# Altium project uz_per_mw_vfd_interface.PrjPCB (part 1 of 2)
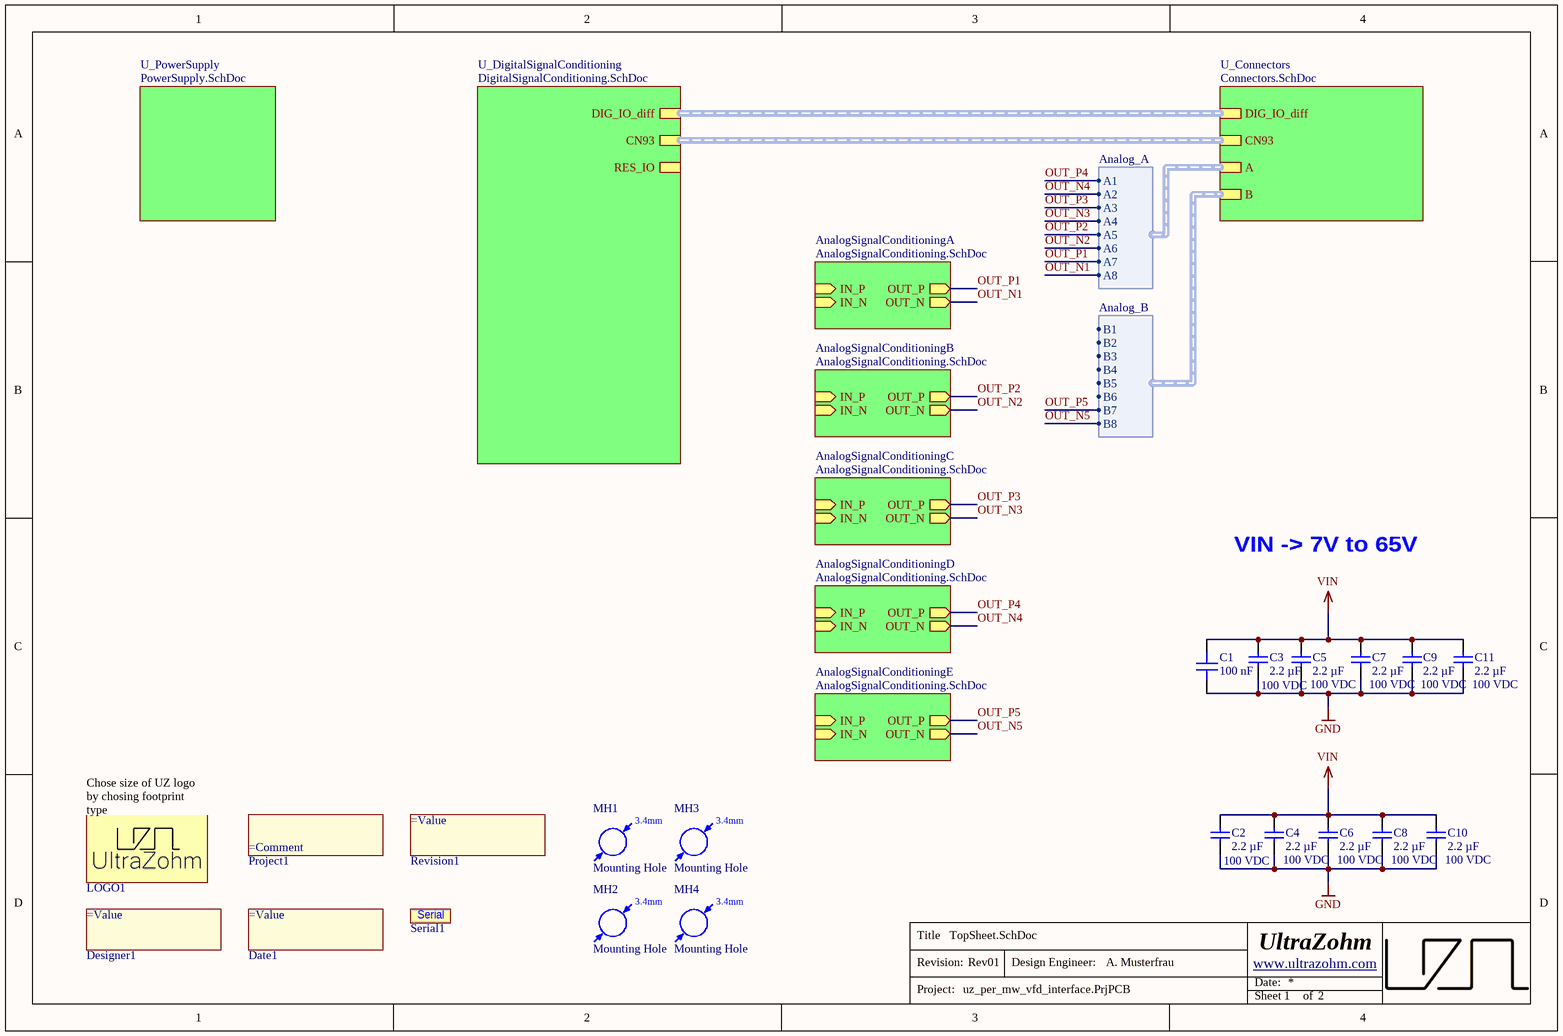
[diagram p0: TopSheet.SchDoc]
Author: A. Musterfrau; AuthorParam: A. Musterfrau; FinDate: 02/23; ProjectNameCustom: UZ_D_Template; ProjectRevision: Rev01
6 sheets, 281 parts. Net scope: hierarchical (ports join the sheet entries above them; power ports are global).
Board file: uz_per_mw_vfd_interface.PcbDoc
Sheets:
  TopSheet.SchDoc
    U_Connectors = Connectors.SchDoc
    U_PowerSupply = PowerSupply.SchDoc
    U_DigitalSignalConditioning = DigitalSignalConditioning.SchDoc
    AnalogSignalConditioningA = AnalogSignalConditioning.SchDoc
    AnalogSignalConditioningB = AnalogSignalConditioning.SchDoc
    AnalogSignalConditioningC = AnalogSignalConditioning.SchDoc
    AnalogSignalConditioningD = AnalogSignalConditioning.SchDoc
    AnalogSignalConditioningE = AnalogSignalConditioning.SchDoc
  DigitalIsolation.SchDoc

## Sheet TopSheet.SchDoc
size A4; Author: A. Musterfrau; CompanyName: Technische Hochschule Nürnberg Georg Simon Ohm; Organization: UltraZohm; Address1: Kesslerplatz 12; Address2: 90489 Nürnberg; Address3: GERMANY; DocumentNumber: 1; SheetNumber: 1; SheetTotal: 2; Website: www.ultrazohm.com

### Parts
C1  100 nF  [C_0603]
C2  2.2 µF  Voltage Rating: 100 VDC  [C_1210_TE]
C3  2.2 µF  Voltage Rating: 100 VDC  [C_1210_TE]
C4  2.2 µF  Voltage Rating: 100 VDC  [C_1210_TE]
C5  2.2 µF  Voltage Rating: 100 VDC  [C_1210_TE]
C6  2.2 µF  Voltage Rating: 100 VDC  [C_1210_TE]
C7  2.2 µF  Voltage Rating: 100 VDC  [C_1210_TE]
C8  2.2 µF  Voltage Rating: 100 VDC  [C_1210_TE]
C9  2.2 µF  Voltage Rating: 100 VDC  [C_1210_TE]
C10  2.2 µF  Voltage Rating: 100 VDC  [C_1210_TE]
C11  2.2 µF  Voltage Rating: 100 VDC  [C_1210_TE]
Date1  (no value)  [COMMENT]  (no BOM)
Designer1  (no value)  [Designator:comment]  (no BOM)
LOGO1  UZ Logo  [UZ_Logo_small]  (value not drawn)  (no BOM)
MH1  Mounting Hole  [MH_3.4]
MH2  Mounting Hole  [MH_3.4]
MH3  Mounting Hole  [MH_3.4]
MH4  Mounting Hole  [MH_3.4]
Project1  (no value)  [COMMENT]  (no BOM)
Revision1  (no value)  [Designator:comment]  (no BOM)
Serial1  Serial #  [SERIAL]  (value not drawn)

### Sub-sheets
AnalogSignalConditioningA = AnalogSignalConditioning.SchDoc: OUT_P (out), OUT_N (out), IN_P (in), IN_N (in)
AnalogSignalConditioningB = AnalogSignalConditioning.SchDoc: OUT_P (out), OUT_N (out), IN_P (in), IN_N (in)
AnalogSignalConditioningC = AnalogSignalConditioning.SchDoc: OUT_P (out), OUT_N (out), IN_P (in), IN_N (in)
AnalogSignalConditioningD = AnalogSignalConditioning.SchDoc: OUT_P (out), OUT_N (out), IN_P (in), IN_N (in)
AnalogSignalConditioningE = AnalogSignalConditioning.SchDoc: OUT_P (out), OUT_N (out), IN_P (in), IN_N (in)
U_Connectors = Connectors.SchDoc: DIG_IO_diff (harness DIG_IO_diff), CN93 (harness Connector CN93), A (harness Analog_A), B (harness Analog_B)
U_DigitalSignalConditioning = DigitalSignalConditioning.SchDoc: DIG_IO_diff (harness DIG_IO_diff), CN93 (harness Connector CN93), RES_IO (harness RES_IO)
U_PowerSupply = PowerSupply.SchDoc: no entries

### Harnesses
Analog_A: A1, A2, A3, A4, A5, A6, A7, A8
Analog_B: B1, B2, B3, B4, B5, B6, B7, B8

### Nets
GND: C1.2 C2.2 C3.2 C4.2 C5.2 C6.2 C7.2 C8.2 C9.2 C10.2 C11.2
VIN: C1.1 C2.1 C3.1 C4.1 C5.1 C6.1 C7.1 C8.1 C9.1 C10.1 C11.1
OUT_N1: sheet AnalogSignalConditioningA/OUT_N, sheet U_Connectors/A.A8
OUT_N2: sheet AnalogSignalConditioningB/OUT_N, sheet U_Connectors/A.A6
OUT_N3: sheet AnalogSignalConditioningC/OUT_N, sheet U_Connectors/A.A4
OUT_N4: sheet AnalogSignalConditioningD/OUT_N, sheet U_Connectors/A.A2
OUT_N5: sheet AnalogSignalConditioningE/OUT_N, sheet U_Connectors/B.B8
OUT_P1: sheet AnalogSignalConditioningA/OUT_P, sheet U_Connectors/A.A7
OUT_P2: sheet AnalogSignalConditioningB/OUT_P, sheet U_Connectors/A.A5
OUT_P3: sheet AnalogSignalConditioningC/OUT_P, sheet U_Connectors/A.A3
OUT_P4: sheet AnalogSignalConditioningD/OUT_P, sheet U_Connectors/A.A1
OUT_P5: sheet AnalogSignalConditioningE/OUT_P, sheet U_Connectors/B.B7

### Buses and harness runs
harness sheet U_Connectors/CN93 = sheet U_DigitalSignalConditioning/CN93
harness sheet U_Connectors/DIG_IO_diff = sheet U_DigitalSignalConditioning/DIG_IO_diff

### Notes on the sheet
- VIN -> 7V to 65V
- (near LOGO1) Chose size of UZ logo by chosing footprint type
- Title
- Revision:
- Design Engineer:
- Date:
- Project:
- Sheet
- of
- (in symbol 6) Serial
- (in symbol Mounting Hole) 3.4mm

### Library data of the parts
C1 = C1608X7S2A104KT000N: 100V 100nF X7S ±10% 0603 Multilayer Ceramic Capacitors MLCC - SMD/SMT ROHS; Manufacturer: TDK; Voltage Rating: 100 VDC; Created from: AGeiger; Value: 100 nF; Supplier 1: LCSC; Supplier Part Number 1: C343025; Tolerance: 10 %; LCSC Part Number: C343025; Manufacturer Part Number: C1608X7S2A104KT000N; PartID: 148; Created On: 20/12/2020 13:54:13; ComponentLink1Description: Datasheet; ComponentLink1URL: https://datasheet.lcsc.com/lcsc/2304140030_TDK-C1608X7S2A104KT000N_C343025.pdf; Component Type: Capacitor 0603; Device Package: 0603; Last Updated: 14/12/2022 12:14:21; Mounting Type: SMD; Operating Temperature: -55 to 125°C; Series: X7R; Type: Capacitor; Live Cycle Status: 1; Stock number: not stored
C2-C11 = FS32X225K101EGG: 100V 2.2uF X7R ±10% 1210 Multilayer Ceramic Capacitors MLCC - SMD/SMT ROHS; Manufacturer: PSA(Prosperity Dielectrics); Created from: AGeiger; Manufacturer Part Number: FS32X225K101EGG; PartID: 170; Created On: 11.03.2025 16:22:30; ComponentLink1Description: Datasheet; ComponentLink1URL: https://www.lcsc.com/datasheet/lcsc_datasheet_2410121308_PSA-Prosperity-Dielectrics-FS32X225K101EGG_C153036.pdf; Component Type: Capacitor 1210; Device Package: 1210; Last Updated: 27.05.2025 19:11:48; Mounting Type: SMD; Operating Temperature: -55 to +125°C; Series: FS; Supplier 1: LCSC; Supplier Part Number 1: C153036; Type: Capacitor; Tolerance: 10%; Value: 2.2 µF; Live Cycle Status: 1; LCSC Part Number: C153036
Date1 = 5: Create a project parameter named "FinDate" this is the value of this component. It is printed on the PCB. Once the parameter is updated (e.g. new revision) it gets updated on the PCB as well; Manufacturer: PCB Manufacturer; Manufacturer Part Number: Project End Date; Value: 02/23; Created from: T. Wendt; PartID: 5; Created On: 01.03.2021 09:01:41; Component Type: Date of Project Finalization; Last Updated: 01.03.2021 09:01:41; Type: Standard (No BOM); Live Cycle Status: 1
Designer1 = 4: Create a project parameter named "Author" this is the value of this component. It is printed on the PCB. Once the parameter is updated (e.g. new revision) it gets updated on the PCB as well; Manufacturer: PCB Manufacturer; Manufacturer Part Number: Project Author; Value: A. Musterfrau; Created from: T. Wendt; PartID: 4; Created On: 01.03.2021 08:53:41; Component Type: Project Author; Last Updated: 01.03.2021 09:20:27; Type: Standard (No BOM); Live Cycle Status: 1
LOGO1 = 1: Official Project Logo of the UltraZohm; Manufacturer: PCB Manufacturer; Manufacturer Part Number: UltraZohm Logo; Created from: T. Wendt; PartID: 1; Created On: 19.02.2021 16:55:56; ComponentLink1Description: Homepage; ComponentLink1URL: https://ultrazohm.com; Component Type: Logo; Last Updated: 02.03.2021 14:31:24; Type: Standard (No BOM); Live Cycle Status: 1
MH1-MH4 = Mounting Hole: Created from: MHlatky; Manufacturer Part Number: Mounting Hole; PartID: 16; Created On: 26.01.2021 09:19:51; ComponentLink1Description: Datasheet; Component Type: Mounting Hole; Device Package: -; Last Updated: 21.03.2022 23:05:12; Manufacturer: Mounting Hole; Supplier 1: Mounting Hole; Supplier Part Number 1: Mounting Hole; Type: Mounting Hole; Value: Mounting Hole; Live Cycle Status: 1; Stock number: not stored
Project1 = 2: Create a project parameter named "ProjectNameCustom" this is the value of this component and it is printed on the PCB.; Manufacturer: PCB Manufacturer; Value: UZ_D_Template; Created from: T. Wendt; PartID: 2; Created On: 01.03.2021 08:43:57; Component Type: Project Name; Last Updated: 01.03.2021 09:07:27; Manufacturer Part Number: Project Name; Type: Standard (No BOM); Live Cycle Status: 1
Revision1 = 3: Create a project parameter named "ProjectRevision" this is the value of this component. It is printed on the PCB. Once the parameter is updated (e.g. new revision) it gets updated on the PCB as well; Manufacturer: PCB Manufacturer; Value: Rev01; Created from: T. Wendt; PartID: 3; Created On: 01.03.2021 08:50:34; Component Type: Project Revision; Last Updated: 01.03.2021 09:28:36; Manufacturer Part Number: Project Revision; Type: Standard (No BOM); Live Cycle Status: 1
Serial1 = 6: Field to put in a serial number; Manufacturer: PCB Manufacturer; Created from: T. Wendt; PartID: 6; Created On: 02.03.2021 14:31:24; Component Type: Serial Number; Last Updated: 02.03.2021 14:31:24; Manufacturer Part Number: Serial Number; Type: Standard (No BOM); Live Cycle Status: 1

## Sheet Connectors.SchDoc
size A4; Author: A. Musterfrau; CompanyName: Technische Hochschule Nürnberg Georg Simon Ohm; Organization: UltraZohm; Address1: Kesslerplatz 12; Address2: 90489 Nürnberg; Address3: GERMANY; DocumentNumber: 2; SheetNumber: 2; SheetTotal: 2; Website: www.ultrazohm.com
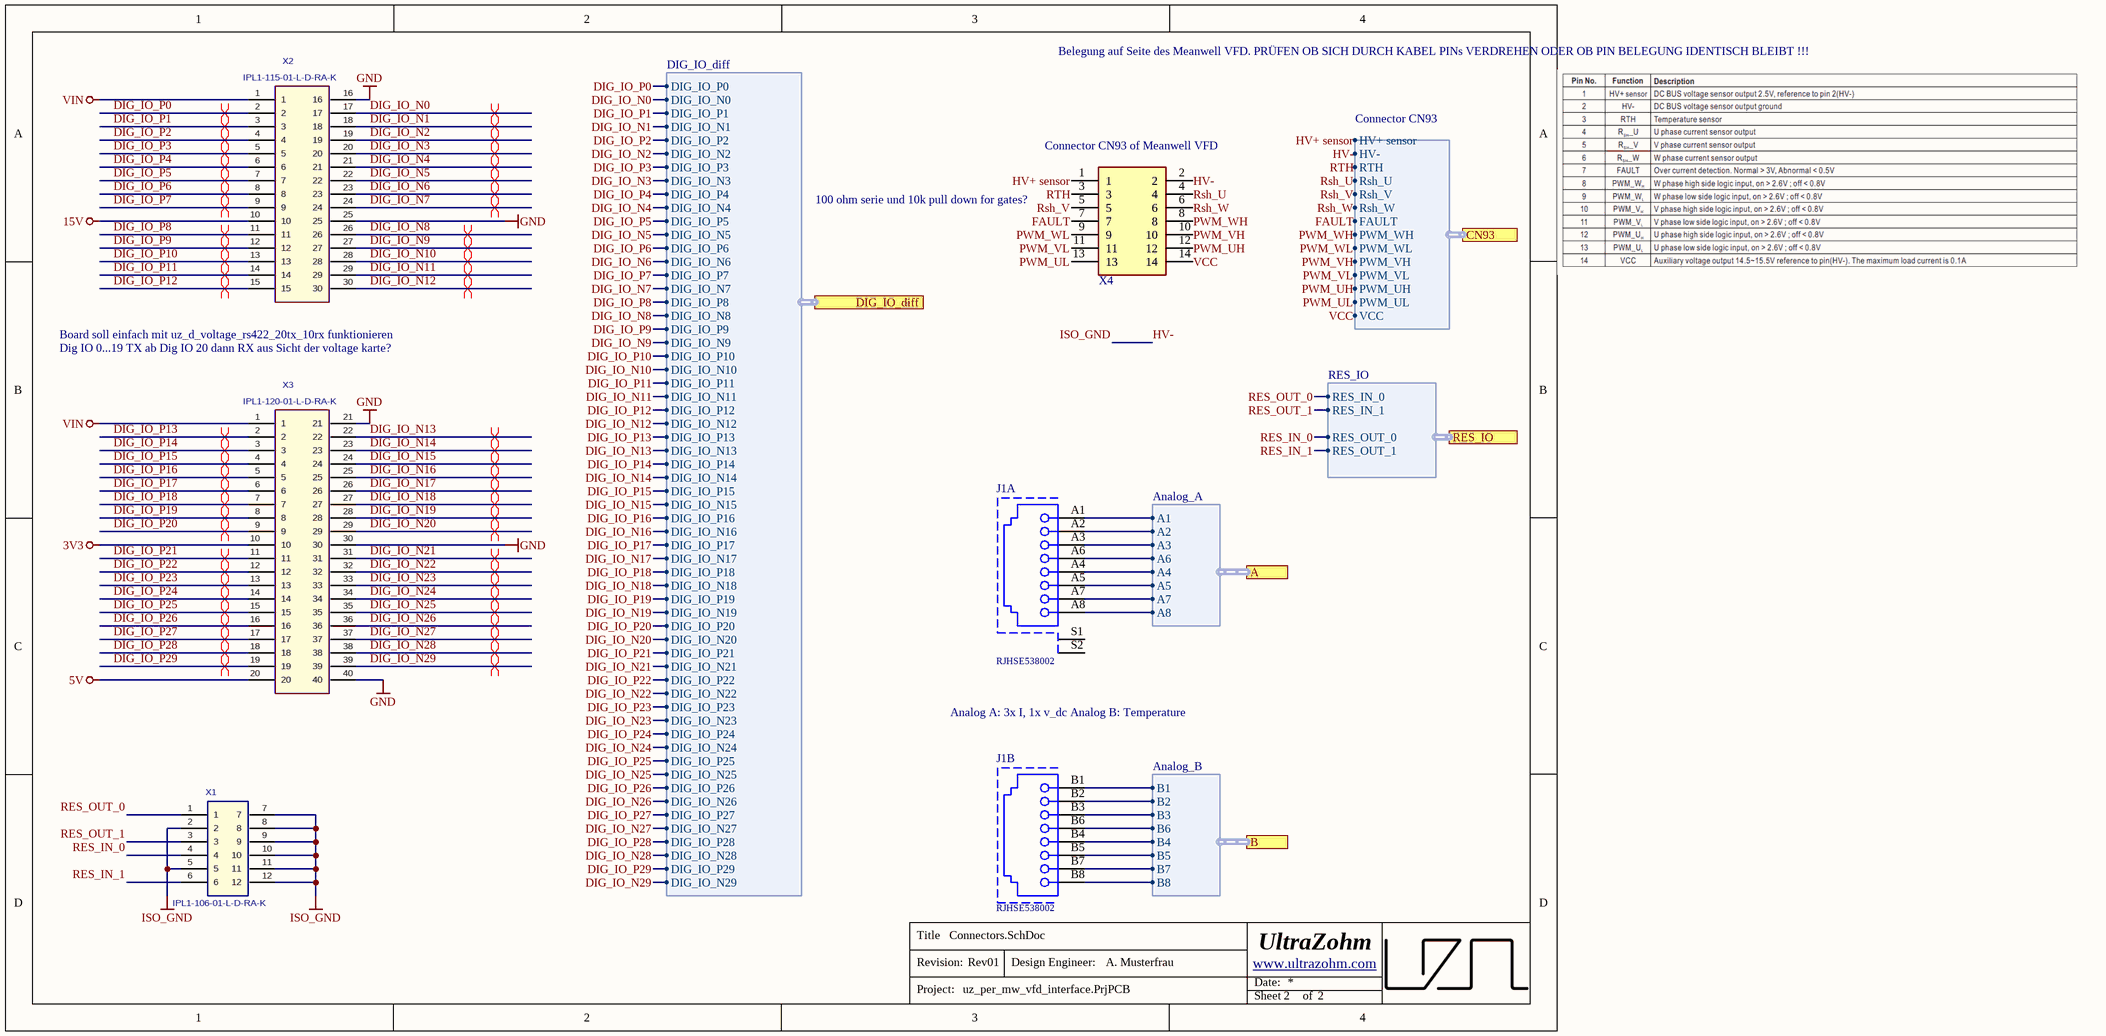
[diagram p1: Connectors.SchDoc]

### Parts
J1  RJHSE538002  [RJHSE-5380-02]  (parts A,B of 2)
X1  IPL1-106-01-L-D-RA-K  [IPL1-106-01-L-D-RA-K]
X2  IPL1-115-01-L-D-RA-K  [IPL1-115-01-XX-D-RA]
X3  IPL1-120-01-L-D-RA-K  [IPL1-120-01-XX-D-RA]
X4  (no value)  [DF11-14DP-2DS(24)]

### Ports
A (harness Analog_A), B (harness Analog_B), CN93 (harness Connector CN93), DIG_IO_diff (harness DIG_IO_diff), RES_IO (harness RES_IO)

### Harnesses
Analog_A: A2, A3, A6, A4, A5, A7, A8, A1
Analog_B: B3, B6, B4, B5, B7, B8, B1, B2
DIG_IO_diff: DIG_IO_N0, DIG_IO_P1, DIG_IO_N1, DIG_IO_P2, DIG_IO_N2, DIG_IO_P3, DIG_IO_N3, DIG_IO_P4, DIG_IO_N4, DIG_IO_P5, DIG_IO_N5, DIG_IO_P6, DIG_IO_N6, DIG_IO_P7, DIG_IO_N7, DIG_IO_P8, DIG_IO_N8, DIG_IO_P9, DIG_IO_N9, DIG_IO_P10, DIG_IO_N10, DIG_IO_P11, DIG_IO_N11, DIG_IO_P12, DIG_IO_N12, DIG_IO_N13, DIG_IO_P14, DIG_IO_N14, DIG_IO_P0, DIG_IO_P15, DIG_IO_N15, DIG_IO_P16, DIG_IO_N16, DIG_IO_P17, DIG_IO_N17, DIG_IO_P18, DIG_IO_N18, DIG_IO_P19, DIG_IO_N19, DIG_IO_P20, DIG_IO_N20, DIG_IO_P21, DIG_IO_P22, DIG_IO_N22, DIG_IO_P23, DIG_IO_N23, DIG_IO_P24, DIG_IO_N24, DIG_IO_P25, DIG_IO_N25, DIG_IO_P26, DIG_IO_N26, DIG_IO_P27, DIG_IO_N27, DIG_IO_P28, DIG_IO_N28, DIG_IO_P29, DIG_IO_N29, DIG_IO_P13, DIG_IO_N21
Connector CN93: HV+ sensor, HV-, RTH, Rsh_U, Rsh_V, Rsh_W, FAULT, PWM_WH, PWM_WL, PWM_VH, PWM_VL, PWM_UH, PWM_UL, VCC
RES_IO: RES_IN_0, RES_IN_1, RES_OUT_0, RES_OUT_1

### Nets
3V3: X3.10
5V: X3.20
15V: X2.10
GND: X2.16 X2.25 X3.21 X3.30 X3.40
HV-: X1.2 X1.5 X1.7 X1.8 X1.9 X1.10 X1.11 X1.12 X4.2 ; port CN93.HV-  [also labelled ISO_GND]
VIN: X2.1 X3.1
DIG_IO_N0: X2.17 ; port DIG_IO_diff.DIG_IO_N0
DIG_IO_N1: X2.18 ; port DIG_IO_diff.DIG_IO_N1
DIG_IO_N2: X2.19 ; port DIG_IO_diff.DIG_IO_N2
DIG_IO_N3: X2.20 ; port DIG_IO_diff.DIG_IO_N3
DIG_IO_N4: X2.21 ; port DIG_IO_diff.DIG_IO_N4
DIG_IO_N5: X2.22 ; port DIG_IO_diff.DIG_IO_N5
DIG_IO_N6: X2.23 ; port DIG_IO_diff.DIG_IO_N6
DIG_IO_N7: X2.24 ; port DIG_IO_diff.DIG_IO_N7
DIG_IO_N8: X2.26 ; port DIG_IO_diff.DIG_IO_N8
DIG_IO_N9: X2.27 ; port DIG_IO_diff.DIG_IO_N9
DIG_IO_N10: X2.28 ; port DIG_IO_diff.DIG_IO_N10
DIG_IO_N11: X2.29 ; port DIG_IO_diff.DIG_IO_N11
DIG_IO_N12: X2.30 ; port DIG_IO_diff.DIG_IO_N12
DIG_IO_N13: X3.22 ; port DIG_IO_diff.DIG_IO_N13
DIG_IO_N14: X3.23 ; port DIG_IO_diff.DIG_IO_N14
DIG_IO_N15: X3.24 ; port DIG_IO_diff.DIG_IO_N15
DIG_IO_N16: X3.25 ; port DIG_IO_diff.DIG_IO_N16
DIG_IO_N17: X3.26 ; port DIG_IO_diff.DIG_IO_N17
DIG_IO_N18: X3.27 ; port DIG_IO_diff.DIG_IO_N18
DIG_IO_N19: X3.28 ; port DIG_IO_diff.DIG_IO_N19
DIG_IO_N20: X3.29 ; port DIG_IO_diff.DIG_IO_N20
DIG_IO_N21: X3.31 ; port DIG_IO_diff.DIG_IO_N21
DIG_IO_N22: X3.32 ; port DIG_IO_diff.DIG_IO_N22
DIG_IO_N23: X3.33 ; port DIG_IO_diff.DIG_IO_N23
DIG_IO_N24: X3.34 ; port DIG_IO_diff.DIG_IO_N24
DIG_IO_N25: X3.35 ; port DIG_IO_diff.DIG_IO_N25
DIG_IO_N26: X3.36 ; port DIG_IO_diff.DIG_IO_N26
DIG_IO_N27: X3.37 ; port DIG_IO_diff.DIG_IO_N27
DIG_IO_N28: X3.38 ; port DIG_IO_diff.DIG_IO_N28
DIG_IO_N29: X3.39 ; port DIG_IO_diff.DIG_IO_N29
DIG_IO_P0: X2.2 ; port DIG_IO_diff.DIG_IO_P0
DIG_IO_P1: X2.3 ; port DIG_IO_diff.DIG_IO_P1
DIG_IO_P2: X2.4 ; port DIG_IO_diff.DIG_IO_P2
DIG_IO_P3: X2.5 ; port DIG_IO_diff.DIG_IO_P3
DIG_IO_P4: X2.6 ; port DIG_IO_diff.DIG_IO_P4
DIG_IO_P5: X2.7 ; port DIG_IO_diff.DIG_IO_P5
DIG_IO_P6: X2.8 ; port DIG_IO_diff.DIG_IO_P6
DIG_IO_P7: X2.9 ; port DIG_IO_diff.DIG_IO_P7
DIG_IO_P8: X2.11 ; port DIG_IO_diff.DIG_IO_P8
DIG_IO_P9: X2.12 ; port DIG_IO_diff.DIG_IO_P9
DIG_IO_P10: X2.13 ; port DIG_IO_diff.DIG_IO_P10
DIG_IO_P11: X2.14 ; port DIG_IO_diff.DIG_IO_P11
DIG_IO_P12: X2.15 ; port DIG_IO_diff.DIG_IO_P12
DIG_IO_P13: X3.2 ; port DIG_IO_diff.DIG_IO_P13
DIG_IO_P14: X3.3 ; port DIG_IO_diff.DIG_IO_P14
DIG_IO_P15: X3.4 ; port DIG_IO_diff.DIG_IO_P15
DIG_IO_P16: X3.5 ; port DIG_IO_diff.DIG_IO_P16
DIG_IO_P17: X3.6 ; port DIG_IO_diff.DIG_IO_P17
DIG_IO_P18: X3.7 ; port DIG_IO_diff.DIG_IO_P18
DIG_IO_P19: X3.8 ; port DIG_IO_diff.DIG_IO_P19
DIG_IO_P20: X3.9 ; port DIG_IO_diff.DIG_IO_P20
DIG_IO_P21: X3.11 ; port DIG_IO_diff.DIG_IO_P21
DIG_IO_P22: X3.12 ; port DIG_IO_diff.DIG_IO_P22
DIG_IO_P23: X3.13 ; port DIG_IO_diff.DIG_IO_P23
DIG_IO_P24: X3.14 ; port DIG_IO_diff.DIG_IO_P24
DIG_IO_P25: X3.15 ; port DIG_IO_diff.DIG_IO_P25
DIG_IO_P26: X3.16 ; port DIG_IO_diff.DIG_IO_P26
DIG_IO_P27: X3.17 ; port DIG_IO_diff.DIG_IO_P27
DIG_IO_P28: X3.18 ; port DIG_IO_diff.DIG_IO_P28
DIG_IO_P29: X3.19 ; port DIG_IO_diff.DIG_IO_P29
FAULT: X4.7 ; port CN93.FAULT
HV+ sensor: X4.1 ; port CN93.HV+ sensor
OUT_N1: J1.A8 ; port A.A8
OUT_N2: J1.A6 ; port A.A6
OUT_N3: J1.A4 ; port A.A4
OUT_N4: J1.A2 ; port A.A2
OUT_N5: J1.B8 ; port B.B8
OUT_P1: J1.A7 ; port A.A7
OUT_P2: J1.A5 ; port A.A5
OUT_P3: J1.A3 ; port A.A3
OUT_P4: J1.A1 ; port A.A1
OUT_P5: J1.B7 ; port B.B7
PWM_UH: X4.12 ; port CN93.PWM_UH
PWM_UL: X4.13 ; port CN93.PWM_UL
PWM_VH: X4.10 ; port CN93.PWM_VH
PWM_VL: X4.11 ; port CN93.PWM_VL
PWM_WH: X4.8 ; port CN93.PWM_WH
PWM_WL: X4.9 ; port CN93.PWM_WL
RES_IN_0: X1.4 ; port RES_IO.RES_OUT_0
RES_IN_1: X1.6 ; port RES_IO.RES_OUT_1
RES_OUT_0: X1.1 ; port RES_IO.RES_IN_0
RES_OUT_1: X1.3 ; port RES_IO.RES_IN_1
Rsh_U: X4.4 ; port CN93.Rsh_U
Rsh_V: X4.5 ; port CN93.Rsh_V
Rsh_W: X4.6 ; port CN93.Rsh_W
RTH: X4.3 ; port CN93.RTH
VCC: X4.14 ; port CN93.VCC
NetJ1_B1: J1.B1 ; port B.B1
NetJ1_B2: J1.B2 ; port B.B2
NetJ1_B3: J1.B3 ; port B.B3
NetJ1_B4: J1.B4 ; port B.B4
NetJ1_B5: J1.B5 ; port B.B5
NetJ1_B6: J1.B6 ; port B.B6

Not connected (* = marked no-connect by the designer): J1 S1 S2

### Layout directives
differential pair: DIG_IO_N0, DIG_IO_N1, DIG_IO_N2, DIG_IO_N3, DIG_IO_N4, DIG_IO_N5, DIG_IO_N6, DIG_IO_N7, DIG_IO_N8, DIG_IO_N9, DIG_IO_N10, DIG_IO_N11, DIG_IO_N12, DIG_IO_N13, DIG_IO_N14, DIG_IO_N15, DIG_IO_N16, DIG_IO_N17, DIG_IO_N18, DIG_IO_N19, DIG_IO_N20, DIG_IO_N21, DIG_IO_N22, DIG_IO_N23, DIG_IO_N24, DIG_IO_N25, DIG_IO_N26, DIG_IO_N27, DIG_IO_N28, DIG_IO_N29, DIG_IO_P0, DIG_IO_P1, DIG_IO_P2, DIG_IO_P3, DIG_IO_P4, DIG_IO_P5, DIG_IO_P6, DIG_IO_P7, DIG_IO_P8, DIG_IO_P9, DIG_IO_P10, DIG_IO_P11, DIG_IO_P12, DIG_IO_P13, DIG_IO_P14, DIG_IO_P15, DIG_IO_P16, DIG_IO_P17, DIG_IO_P18, DIG_IO_P19, DIG_IO_P20, DIG_IO_P21, DIG_IO_P22, DIG_IO_P23, DIG_IO_P24, DIG_IO_P25, DIG_IO_P26, DIG_IO_P27, DIG_IO_P28, DIG_IO_P29

### Notes on the sheet
- Belegung auf Seite des Meanwell VFD. PRÜFEN OB SICH DURCH KABEL PINs VERDREHEN ODER OB PIN BELEGUNG IDENTISCH BLEIBT !!!
- (near X4) Connector CN93 of Meanwell VFD
- (near X4) 100 ohm serie und 10k pull down for gates?
- (near X2) Board soll einfach mit uz_d_voltage_rs422_20tx_10rx funktionieren
- Dig IO 0...19 TX ab Dig IO 20 dann RX aus Sicht der voltage karte?
- Analog A: 3x I, 1x v_dc Analog B: Temperature
- Title
- Revision:
- Design Engineer:
- Date:
- Project:
- Sheet
- of

### Library data of the parts
J1 = RJHSE538002: CAT5, RJ45 Connector, 1x2; Manufacturer: Amphenol; Created from: MGremer; Manufacturer Part Number: RJHSE538002; PartID: 4; Created On: 22.02.2021 16:43:38; ComponentLink1Description: Datasheet; ComponentLink1URL: https://www.farnell.com/cad/2360382.pdf; Component Type: RJ45 Connector; Device Package: RJ45; Last Updated: 22.02.2021 16:43:38; Mounting Type: THT; Series: RJHSE; Supplier 1: Farnell; Supplier Part Number 1: 1860605; Type: RJ45 Connector; Live Cycle Status: 1; Stock number: not stored
X1 = IPL1-106-01-L-D-RA-K: 2.54 mm Double Row Terminal Assembly (right angle); Manufacturer: SAMTEC; Created from: MGremer; Number of positions: 6; Manufacturer Part Number: IPL1-106-01-L-D-RA-K; PartID: 12; Created On: 30.11.2020 10:28:12; ComponentLink1Description: Homepage; ComponentLink1URL: https://www.samtec.com/products/ipl1; Component Type: Samtec Connector; Device Package: Connector; Last Updated: 15.02.2021 09:17:39; Mounting Type: THT; Supplier 1: SAMTEC; Supplier Part Number 1: IPL1-106-01-L-D-RA-K; Type: Connector; Live Cycle Status: 1; Number of rows: 2; Stock number: not stored
X2 = IPL1-115-01-L-D-RA-K: Terminal Assembly, Double Row, Right Angle, Thru-Hole, 2.54 mm x 2.54 mm Pitch, 30 Pins; Manufacturer: SAMTEC; Created from: TWendt; Number of positions: 30; Manufacturer Part Number: IPL1-115-01-L-D-RA-K; PartID: 34; Created On: 12.02.2021 15:31:18; ComponentLink1Description: Homepage; ComponentLink1URL: https://www.samtec.com/products/ipl1; Component Type: Samtec Connector; Device Package: Connector; Last Updated: 15.02.2021 10:07:42; Supplier 1: SAMTEC; Supplier Part Number 1: IPL1-115-01-L-D-RA-K; Type: Connector; Live Cycle Status: 1; Number of rows: 2; Stock number: not stored
X3 = IPL1-120-01-L-D-RA-K: Terminal Assembly, Double Row, Right Angle, Thru-Hole, 2.54 mm x 2.54 mm Pitch, 40 Pins; Manufacturer: SAMTEC; Created from: TWendt; Number of positions: 40; Manufacturer Part Number: IPL1-120-01-L-D-RA-K; PartID: 33; Created On: 12.02.2021 15:26:11; ComponentLink1Description: Homepage; ComponentLink1URL: https://www.samtec.com/products/ipl1; Component Type: Samtec Connector; Device Package: Connector; Last Updated: 15.02.2021 10:07:42; Mounting Type: THT; Supplier 1: SAMTEC; Supplier Part Number 1: IPL1-120-01-L-D-RA-K; Type: Connector; Live Cycle Status: 1; Number of rows: 2; Stock number: not stored
X4 = DF11-14DP-2DS(24): Sockel & Kabelgehäuse 2MM R/A PCB HEADER 14P DR THRU-HOLE TIN; Manufacturer: Hirose Connector; Created from: FRosner; Manufacturer Part Number: DF11-14DP-2DS(24); PartID: 74; Created On: 29.05.2026 08:10:33; ComponentLink1Description: Datasheet; ComponentLink1URL: https://www.hirose.com/product/download/?distributor=all&type=2d&lang=en&num=DF11-14DP-2DS(24); Last Updated: 29.05.2026 08:10:33; Mounting Type: THT; Operating Temperature: -30 °C to +85 °C; Series: DF11; Supplier 1: Mouser; Supplier Part Number 1: 798-DF11-14DP-2DS24; Supplier 2: LCSC; Supplier Part Number 2: C5440913; Value: DF11-14DP-2DS(24); LCSC Part Number: C5440913

## Sheet PowerSupply.SchDoc
size A4; Author: A. Musterfrau; CompanyName: Technische Hochschule Nürnberg Georg Simon Ohm; Organization: UltraZohm; Address1: Kesslerplatz 12; Address2: 90489 Nürnberg; Address3: GERMANY; DocumentNumber: 2; SheetNumber: 2; SheetTotal: 2; Website: www.ultrazohm.com
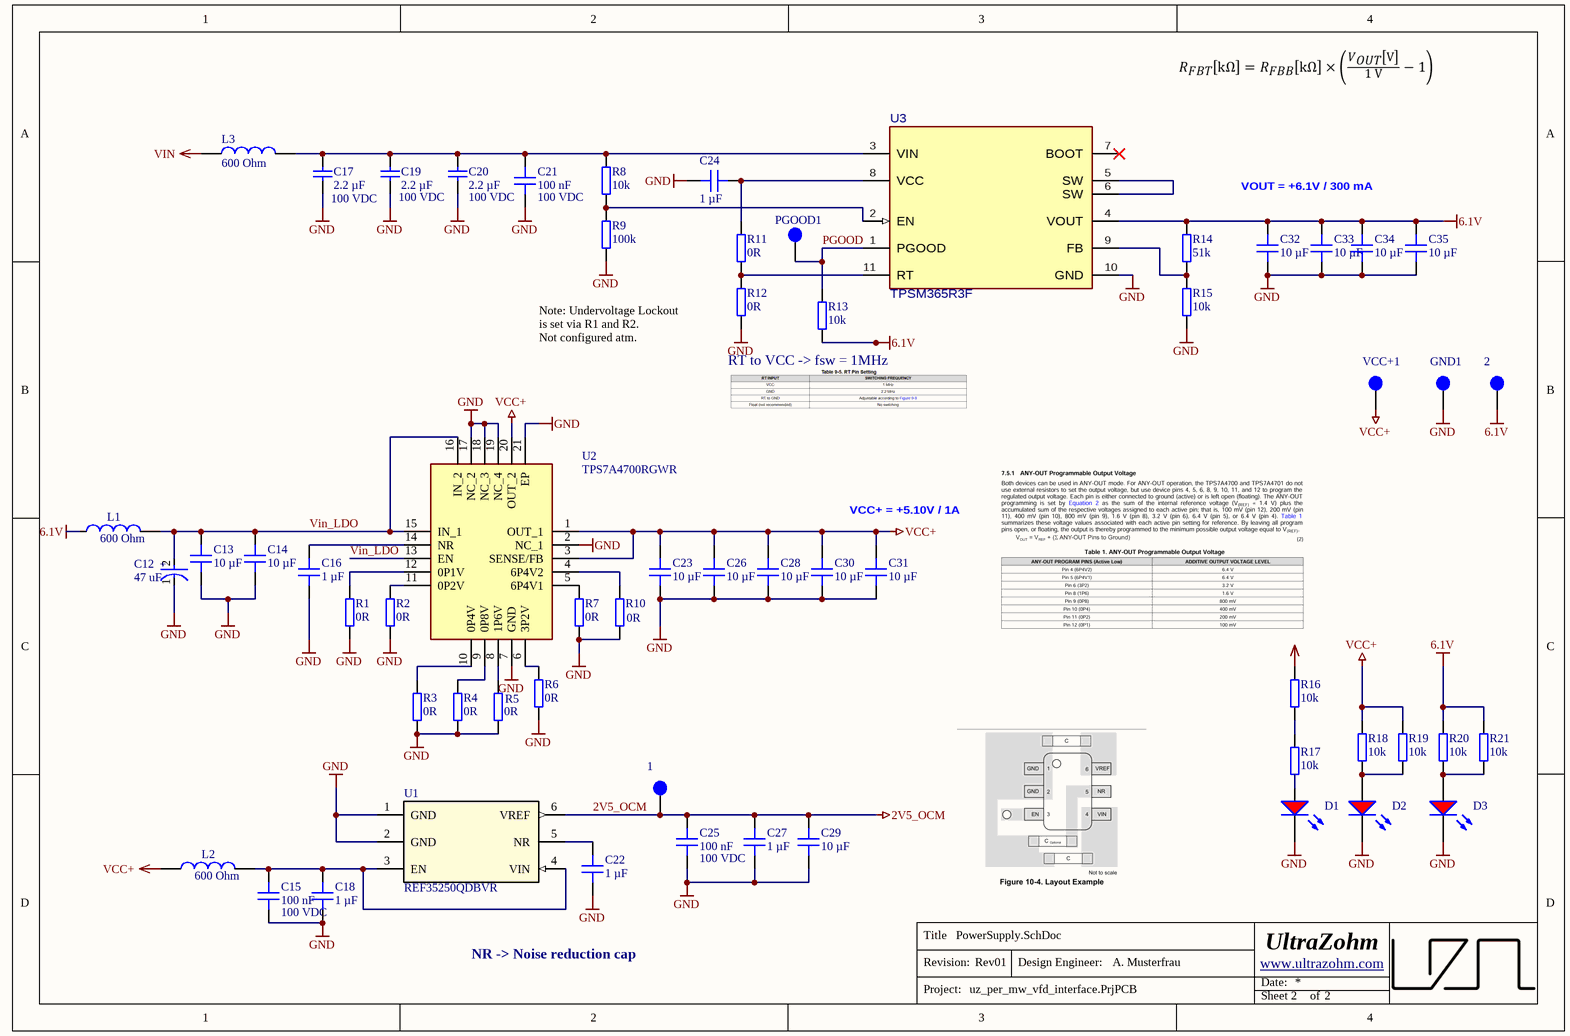
[diagram p2: PowerSupply.SchDoc]

### Parts
1  2V5  [TP_1mm]  (value not drawn)  (no BOM)
2  6.1V  [TP_1mm]  (value not drawn)  (no BOM)
C12  47 uF  [10TPE47MAZB]
C13  10 µF  [C0805]
C14  10 µF  [C0805]
C15  100 nF  Voltage Rating: 100 VDC  [C_0603]
C16  1 µF  [C_0603]
C17  2.2 µF  Voltage Rating: 100 VDC  [C_1210_TE]
C18  1 µF  [C_0603]
C19  2.2 µF  Voltage Rating: 100 VDC  [C_1210_TE]
C20  2.2 µF  Voltage Rating: 100 VDC  [C_1210_TE]
C21  100 nF  Voltage Rating: 100 VDC  [C_0603]
C22  1 µF  [C_0603]
C23  10 µF  [C0805]
C24  1 µF  [C_0603]
C25  100 nF  Voltage Rating: 100 VDC  [C_0603]
C26  10 µF  [C0805]
C27  1 µF  [C_0603]
C28  10 µF  [C0805]
C29  10 µF  [C0805]
C30  10 µF  [C0805]
C31  10 µF  [C0805]
C32  10 µF  [C0805]
C33  10 µF  [C0805]
C34  10 µF  [C0805]
C35  10 µF  [C0805]
D1  KT-0603R  [WL-SMCW_0603]  (value not drawn)
D2  KT-0603R  [WL-SMCW_0603]  (value not drawn)
D3  KT-0603R  [WL-SMCW_0603]  (value not drawn)
GND1  Testpoint 1mm  [TP_1mm]  (value not drawn)  (no BOM)
L1  600 Ohm  [WE-CBF_0805_High Current]
L2  600 Ohm  [WE-CBF_0805_High Current]
L3  600 Ohm  [WE-CBF_0805_High Current]
PGOOD1  Testpoint 1mm  [TP_1mm]  (value not drawn)  (no BOM)
R1  0R  [RES 0603_1608]
R2  0R  [RES 0603_1608]
R3  0R  [RES 0603_1608]
R4  0R  [RES 0603_1608]
R5  0R  [RES 0603_1608]
R6  0R  [RES 0603_1608]
R7  0R  [RES 0603_1608]
R8  10k  [RES 0603_1608]
R9  100k  [RES 0603_1608]
R10  0R  [RES 0603_1608]
R11  0R  [RES 0603_1608]
R12  0R  [RES 0603_1608]
R13  10k  [RES 0603_1608]
R14  51k  [R_0603_TE]
R15  10k  [RES 0603_1608]
R16  10k  [RES 0603_1608]
R17  10k  [RES 0603_1608]
R18  10k  [RES 0603_1608]
R19  10k  [RES 0603_1608]
R20  10k  [RES 0603_1608]
R21  10k  [RES 0603_1608]
U1  REF35250QDBVR  [TI_SOT23_6-Leads]
U2  TPS7A4700RGWR  [QFN65P500X500X100-21N-D]
U3  TPSM365R3F  [RDN0011A-MFG]
VCC+1  VCC+  [TP_1mm]  (value not drawn)  (no BOM)

### Nets
2V5_OCM: 1.1 C25.2 C27.2 C29.2 U1.6(VREF)
6.1V: 2.1 C32.2 C33.2 C34.2 C35.2 L1.1 R13.2 R14.2 R20.1 R21.1 U3.4(VOUT)
GND: C12.1(C) C13.1 C14.1 C15.1 C16.2 C17.2 C18.1 C19.2 C20.2 C21.1 C22.1 C23.1 C24.2 C25.1 C26.1 C27.1 C28.1 C29.1 C30.1 C31.1 C32.1 C33.1 C34.1 C35.1 D1.1(K) D2.1(K) D3.1(K) GND1.1 R1.2 R2.1 R3.1 R4.1 R5.1 R6.2 R7.1 R9.2 R10.1 R12.1 R15.2 U1.1(GND) U1.2(GND) U2.2(NC_1) U2.7(GND) U2.17(NC_2) U2.18(NC_3) U2.19(NC_4) U2.21(EP) U3.10(GND)
VCC+: C23.2 C26.2 C28.2 C30.2 C31.2 L2.1 R18.1 R19.1 U2.1(OUT_1) U2.3(SENSE/FB) U2.20(OUT_2) VCC+1.1
VIN: L3.1 R16.1
PGOOD: PGOOD1.1 R13.1 U3.1(PGOOD)
Vin_LDO: C12.2(A) C13.2 C14.2 L1.2 U2.13(EN) U2.15(IN_1) U2.16(IN_2)
NetC15_2: C15.2 C18.2 L2.2 U1.3(EN) U1.4(VIN)
NetC16_1: C16.1 U2.14(NR)
NetC17_1: C17.1 C19.1 C20.1 C21.2 L3.2 R8.2 U3.3(VIN)
NetC22_2: C22.2 U1.5(NR)
NetC24_1: C24.1 R11.2 U3.8(VCC)
NetD1_2: D1.2(A) R17.2
NetD2_2: D2.2(A) R18.2 R19.2
NetD3_2: D3.2(A) R20.2 R21.2
NetR1_1: R1.1 U2.12(0P1V)
NetR2_2: R2.2 U2.11(0P2V)
NetR3_2: R3.2 U2.10(0P4V)
NetR4_2: R4.2 U2.9(0P8V)
NetR5_2: R5.2 U2.8(1P6V)
NetR6_1: R6.1 U2.6(3P2V)
NetR7_2: R7.2 U2.5(6P4V1)
NetR8_1: R8.1 R9.1 U3.2(EN)
NetR10_2: R10.2 U2.4(6P4V2)
NetR11_1: R11.1 R12.2 U3.11(RT)
NetR14_1: R14.1 R15.1 U3.9(FB)
NetR16_2: R16.2 R17.1
NetU3_5: U3.5(SW) U3.6(SW)

Not connected (* = marked no-connect by the designer): U3 7(BOOT)*

### Notes on the sheet
- VOUT = +6.1V / 300 mA
- Note: Undervoltage Lockout is set via R1 and R2.
  Not configured atm.
- RT to VCC -> fsw = 1MHz
- VCC+ = +5.10V / 1A
- NR -> Noise reduction cap
- Title
- Revision:
- Design Engineer:
- Date:
- Project:
- Sheet
- of
- (in symbol 10TPE47MAZB) +

### Library data of the parts
1 2 VCC+1 = NULL: Testpoint 1mm; Manufacturer Part Number: NULL; Created from: AGeiger; Created: 2018_06_25_AGeiger; Value: Testpoint 1mm; PartID: 9; Created On: 20/09/2022 13:14:57; Component Type: Testpoint; Last Updated: 20/09/2022 13:15:39; Manufacturer: NULL; Supplier 1: NULL; Supplier Part Number 1: NULL; Type: Testpoint; Live Cycle Status: 1
C12 = 10TPE47MAZB: Tantalum Capacitors - Polymer 10volts 47uF ESR 35mohm; Manufacturer: Panasonic; Tolerance: 20 %; Voltage Rating: 10 VDC; Created from: Kilhan; Manufacturer Part Number: 10TPE47MAZB; PartID: 173; Created On: 26/06/2025 16:14:36; ComponentLink1Description: Datasheet; ComponentLink1URL: https://industrial.panasonic.com/cdbs/www-data/pdf/AAA8000/AAA8000C36.pdf; Component Type: Tantalum Capacitor; Device Package: 1210 (3528 metric); Last Updated: 26/06/2025 16:39:07; Mounting Type: SMD; Operating Temperature: -55 to +105°C; Series: TPE; Supplier 1: Mouser; Supplier Part Number 1: 667-10TPE47MAZB; Supplier 2: LCSC; Supplier Part Number 2: C147768; Type: Capacitor; Value: 47 uF; Live Cycle Status: 1; LCSC Part Number: C147768; Stock number: not stored
C13 C14 C23 C26 C28-C35 = GRM21BR6YA106KE43L: Capacitor 0805, 35 VDC, 10 µF, X5R; Manufacturer: muRata; Tolerance: 10 %; Voltage Rating: 35 VDC; Created from: MGremer; Manufacturer Part Number: GRM21BR6YA106KE43L; PartID: 28; Created On: 20.12.2020 13:54:13; ComponentLink1Description: Datasheet; ComponentLink1URL: https://www.mouser.de/datasheet/2/281/murata_03052018_GRM_Series_1-1310166.pdf; Component Type: Capacitor 0805; Device Package: 0805; Last Updated: 20.12.2020 17:44:37; Mounting Type: SMD; Operating Temperature: -55 - 85°C; Series: GRM; Supplier 1: Mouser; Supplier Part Number 1: 81-GRM21BR6YA106KE3L; Type: Capacitor; Value: 10 µF; Live Cycle Status: 1; Stock number: Labor SMD Container; LCSC Part Number: C162422
C15 C21 C25 = C1608X7S2A104KT000N: 100V 100nF X7S ±10% 0603 Multilayer Ceramic Capacitors MLCC - SMD/SMT ROHS; Manufacturer: TDK; Created from: AGeiger; Manufacturer Part Number: C1608X7S2A104KT000N; PartID: 148; Created On: 20.12.2020 13:54:13; ComponentLink1Description: Datasheet; ComponentLink1URL: https://datasheet.lcsc.com/lcsc/2304140030_TDK-C1608X7S2A104KT000N_C343025.pdf; Component Type: Capacitor 0603; Device Package: 0603; Last Updated: 14.12.2022 12:14:21; Mounting Type: SMD; Operating Temperature: -55 to 125°C; Series: X7R; Supplier 1: LCSC; Supplier Part Number 1: C343025; Type: Capacitor; Tolerance: 10 %; Value: 100 nF; Live Cycle Status: 1; LCSC Part Number: C343025; Stock number: not stored
C16 C18 C22 C24 C27 = CL10A105KB8NNNC: 50V 1uF X5R ±10% 0603  Multilayer Ceramic Capacitors MLCC - SMD/SMT ROHS; Manufacturer: Samsung Electro-Mechanics; Voltage Rating: 50 VDC; Created from: MGremer; Manufacturer Part Number: CL10A105KB8NNNC; ComponentLink1Description: Datasheet; ComponentLink1URL: https://datasheet.lcsc.com/lcsc/1810261812_Samsung-Electro-Mechanics-CL10A105KB8NNNC_C15849.pdf; Component Type: Capacitor 0603; Device Package: 0603; Mounting Type: SMD; Operating Temperature: -55 - 85°C; Supplier 1: LCSC; Supplier Part Number 1: C15849; Type: Capacitor; Tolerance: 10 %; Value: 1 µF; Live Cycle Status: 1; Stock number: Labor SMD Container; LCSC Part Number: C15849; PartID: 5; Created On: 20/12/2020 13:54:13; Last Updated: 28/11/2022 17:23:01; Series: M
C17 C19 C20 = FS32X225K101EGG: as C2 on sheet TopSheet; Manufacturer Part Number: FS32X225K101EGG; PartID: 170; Created On: 11.03.2025 16:22:30; ComponentLink1Description: Datasheet; ComponentLink1URL: https://www.lcsc.com/datasheet/lcsc_datasheet_2410121308_PSA-Prosperity-Dielectrics-FS32X225K101EGG_C153036.pdf; Component Type: Capacitor 1210; Device Package: 1210; Last Updated: 27.05.2025 19:11:48; Mounting Type: SMD; Operating Temperature: -55 to +125°C; Series: FS; Supplier 1: LCSC; Supplier Part Number 1: C153036; Type: Capacitor; Tolerance: 10%; Value: 2.2 µF; Live Cycle Status: 1; LCSC Part Number: C153036
D1-D3 = KT-0603R: LED RED 520~625NM 90~100MCD@20MA TOP VIEW 0603 ROHS; Manufacturer: Hubei KENTO Elec; Type: Standard; Created from: T. Wendt; Forward Current I_f: 20 mA; Forward Voltage U_f: 2.1 V; Wavelength: 620 nm; Light Intensity: 110 mcd; Nominal Power: 42 mW; Manufacturer Part Number: KT-0603R; PartID: 8; Created On: 03/03/2021 10:06:23; ComponentLink1Description: Datasheet; ComponentLink1URL: https://datasheet.lcsc.com/szlcsc/Hubei-KENTO-Elec-KT-0603R_C2286.pdf; Component Type: LED Diode; Device Package: 0603; Last Updated: 04/03/2021 09:02:49; Mounting Type: SMD; Operating Temperature: -40 - 85 °C; Supplier 1: LCSC; Supplier Part Number 1: C2286; Live Cycle Status: 1; Stock number: not stored; Color: red; LCSC Part Number: C2286
GND1 PGOOD1 = NULL: Manufacturer Part Number: NULL; Created from: AGeiger; Created: 2018_06_25_AGeiger; Value: Testpoint 1mm; PartID: 9; Component Type: Testpoint; Manufacturer: NULL; Supplier 1: NULL; Supplier Part Number 1: NULL; Type: Testpoint; Live Cycle Status: 1
  GND1: Created On: 20/09/2022 13:14:57; Last Updated: 20/09/2022 13:15:39
  PGOOD1: Created On: 20.09.2022 13:14:57; Last Updated: 20.09.2022 13:15:39
L1-L3 = 742792040: Inductance, 0805, 100 MHz, 600 Ohm, 2 A; Manufacturer: Wuerth Elektronik; Type: Inductance SMD; DC current: 2 A; Created from: AGeiger; ComponentLink1Description: Datasheet; ComponentLink1URL: https://www.mouser.de/datasheet/2/445/742792040-1720361.pdf; Value: 600 Ohm; Supplier 1: Mouser; Supplier Part Number 1: 710-742792040; LCSC Part Number: C2661857; Manufacturer Part Number: 742792040; PartID: 1; Created On: 18/01/2021 14:53:17; Component Type: Inductance; Device Package: 0805; Last Updated: 22/08/2024 07:43:45; Mounting Type: SMD; Operating Temperature: -55 - 125 °C; Series: WE-CBF; Live Cycle Status: 1; Stock number: not stored
R1-R7 R10-R12 = RC0603JR-070RL: SMD resistor E24 series; Manufacturer: YAGEO; Tolerance: 5%; Created from: MGremer; Manufacturer Part Number: RC0603JR-070RL; PartID: 1; Created On: 14/12/2020 16:17:14; ComponentLink1Description: Datasheet; ComponentLink1URL: https://www.mouser.de/datasheet/2/447/PYu-RC_Group_51_RoHS_L_10-1664068.pdf; Component Type: SMD resistor; Device Package: 0603; Last Updated: 04/03/2021 09:09:42; Mounting Type: SMD; Supplier 1: Mouser; Supplier Part Number 1: 603-RC0603JR-070RL; Supplier 2: LCSC; Supplier Part Number 2: C21189; Type: Resistor; Value: 0R; Live Cycle Status: 1; Stock number: Labor SMD Container; LCSC Part Number: C21189
R8 R13 R15-R21 = 0603WAF1002T5E: SMD resistor 1%; Manufacturer: UNI-ROYAL; Created from: AGeiger; Manufacturer Part Number: 0603WAF1002T5E; PartID: 265; Created On: 01/06/2023 06:49:29; Value: 10k; Device Package: 0603; Tolerance: 1%; Mounting Type: SMD; Last Updated: 01/06/2023 06:49:29; ComponentLink1Description: Datasheet; ComponentLink1URL: https://datasheet.lcsc.com/lcsc/2206010045_UNI-ROYAL-Uniroyal-Elec-0603WAF1002T5E_C25804.pdf; Component Type: SMD resistor; Supplier 1: LCSC; Supplier Part Number 1: C25804; Type: Resistor; Live Cycle Status: 1; LCSC Part Number: C25804
R9 = CRCW0603100KFKEAC: SMD resistor 1%; Manufacturer: Vishay; Created from: MGremer; Manufacturer Part Number: CRCW0603100KFKEAC; PartID: 181; Created On: 14/12/2020 16:17:14; Value: 100k; Device Package: 0603; Tolerance: 1%; Mounting Type: SMD; Last Updated: 21/05/2021 10:03:40; ComponentLink1Description: Datasheet; ComponentLink1URL: https://www.mouser.de/datasheet/2/427/crcwce3-1762584.pdf; Component Type: SMD resistor; Supplier 1: Mouser; Supplier Part Number 1: 71-CRCW0603100KFKEAC; Type: Resistor; Live Cycle Status: 1; Stock number: not stored
R14 = 0603WAF5102T5E: 100mW Thick Film Resistors 75V ±100ppm/℃ ±1% 51kΩ 0603 Chip Resistor - Surface Mount ROHS; Manufacturer: UNI-ROYAL(Uniroyal Elec); Created from: KIlhan; Manufacturer Part Number: 0603WAF5102T5E; PartID: 363; Created On: 16/06/2025 17:07:49; ComponentLink1Description: Datasheet; ComponentLink1URL: https://jlcpcb.com/api/file/downloadByFileSystemAccessId/8579706288655699968; Component Type: SMD resistor; Device Package: 0603; Last Updated: 18/06/2025 13:28:44; Mounting Type: SMD; Supplier 1: LCSC; Supplier Part Number 1: C23196; Type: Resistor; Tolerance: 1%; Value: 51k; Live Cycle Status: 1; Stock number: not stored; LCSC Part Number: C23196
U1 = REF35250QDBVR: 2.5V ±0.05% 2.75V~6V 10mA Fixed SOT-23-6 Voltage Reference ROHS; Manufacturer: Texas Instruments; Created from: KIlhan; Manufacturer Part Number: REF35250QDBVR; PartID: 18; Created On: 20/03/2025 09:42:36; ComponentLink1Description: Datasheet; ComponentLink1URL: https://wmsc.lcsc.com/wmsc/upload/file/pdf/v2/lcsc/2311301509_Texas-Instruments-REF35250QDBVR_C6265005.pdf; Component Type: Voltage Reference; Device Package: SMD; Last Updated: 23/03/2025 21:09:34; Mounting Type: SMD; Operating Temperature: -40℃~+125℃; Supplier 1: Mouser; Supplier Part Number 1: 595-REF35250QDBVR; Supplier 2: LCSC; Supplier Part Number 2: C6265005; Type: Voltage Reference; Value: 2.5V; Live Cycle Status: 1; LCSC Part Number: C6265005; Stock number: not stored
U2 = TPS7A4700RGWR: 1-A, 36-V, low-noise, high-PSRR, low-dropout voltage regulator with enable; Manufacturer_Name: Texas Instruments; Geometry.Height: 1mm; Value: 5 V; Created from: KIlhan; Manufacturer_Part_Number: TPS7A4701RGWR; Mouser Part Number: 595-TPS7A4701RGWR; Mouser Price/Stock: https://www.mouser.co.uk/ProductDetail/Texas-Instruments/TPS7A4701RGWR?qs=2YfbMANv382WBl7zEiZ0Og%3D%3D; Arrow Part Number: TPS7A4701RGWR; Arrow Price/Stock: https://www.arrow.com/en/products/tps7a4701rgwr/texas-instruments?utm_currency=USD&region=nac; Datasheet Link: http://www.ti.com/lit/gpn/tps7a47; Manufacturer Part Number: TPS7A4700RGWR; PartID: 20; Created On: 16/06/2025 23:37:46; ComponentLink1Description: Datasheet; ComponentLink1URL: https://www.ti.com/lit/ds/symlink/tps7a47.pdf?ts=1750053970117&ref_url=https%253A%252F%252Fwww.ti.com%252Fproduct%252FTPS7A47%253FkeyMatch%253DTPS7A4701RGWR%2526tisearch%253Duniversal_search%2526usecase%253DOPN-ALT; Component Type: LDO; Device Package: VQFN-20-EP(5x5); Last Updated: 18/06/2025 15:16:15; Manufacturer: Texas Instruments; Mounting Type: SMD; Operating Temperature: -40 to +125 °C; Series: TPS7A47; Supplier 1: Mouser; Supplier Part Number 1: 595-TPS7A4700RGWR; Supplier 2: LCSC; Supplier Part Number 2: C114839; Type: LDO; Live Cycle Status: 1; LCSC Part Number: C114839; Stock number: not stored
U3 = TPSM365R6FRDNR: 3-V to 65-V input, 1-V to 13-V output, 0.6-A synchronous buck converter power module; Manufacturer Part Number: TPSM365R3FRDNR; Manufacturer: Texas Instruments; Created from: KIlhan; PartID: 42; Created On: 16/06/2025 17:12:20; ComponentLink1Description: Datasheet; ComponentLink1URL: https://www.ti.com/lit/ds/symlink/tpsm365r3.pdf?ts=1747982141267; Component Type: Power module with inductor; Device Package: QFN-FCMOD; Last Updated: 16/06/2025 17:12:20; Mounting Type: SMD; Operating Temperature: -40 to +125 °C; Series: TPSM365; Supplier 1: LCSC; Supplier Part Number 1: C20346006; Type: Power module (integrated inductor); Value: TPSM365R3F; Live Cycle Status: 1; LCSC Part Number: C20346006; Stock number: not stored; Supplier 2: Mouser; Supplier Part Number 2: 595-TPSM365R6FRDNR

## Sheet DigitalSignalConditioning.SchDoc
size A4; Author: A. Musterfrau; CompanyName: Technische Hochschule Nürnberg Georg Simon Ohm; Organization: UltraZohm; Address1: Kesslerplatz 12; Address2: 90489 Nürnberg; Address3: GERMANY; DocumentNumber: 2; SheetNumber: 2; SheetTotal: 2; Website: www.ultrazohm.com
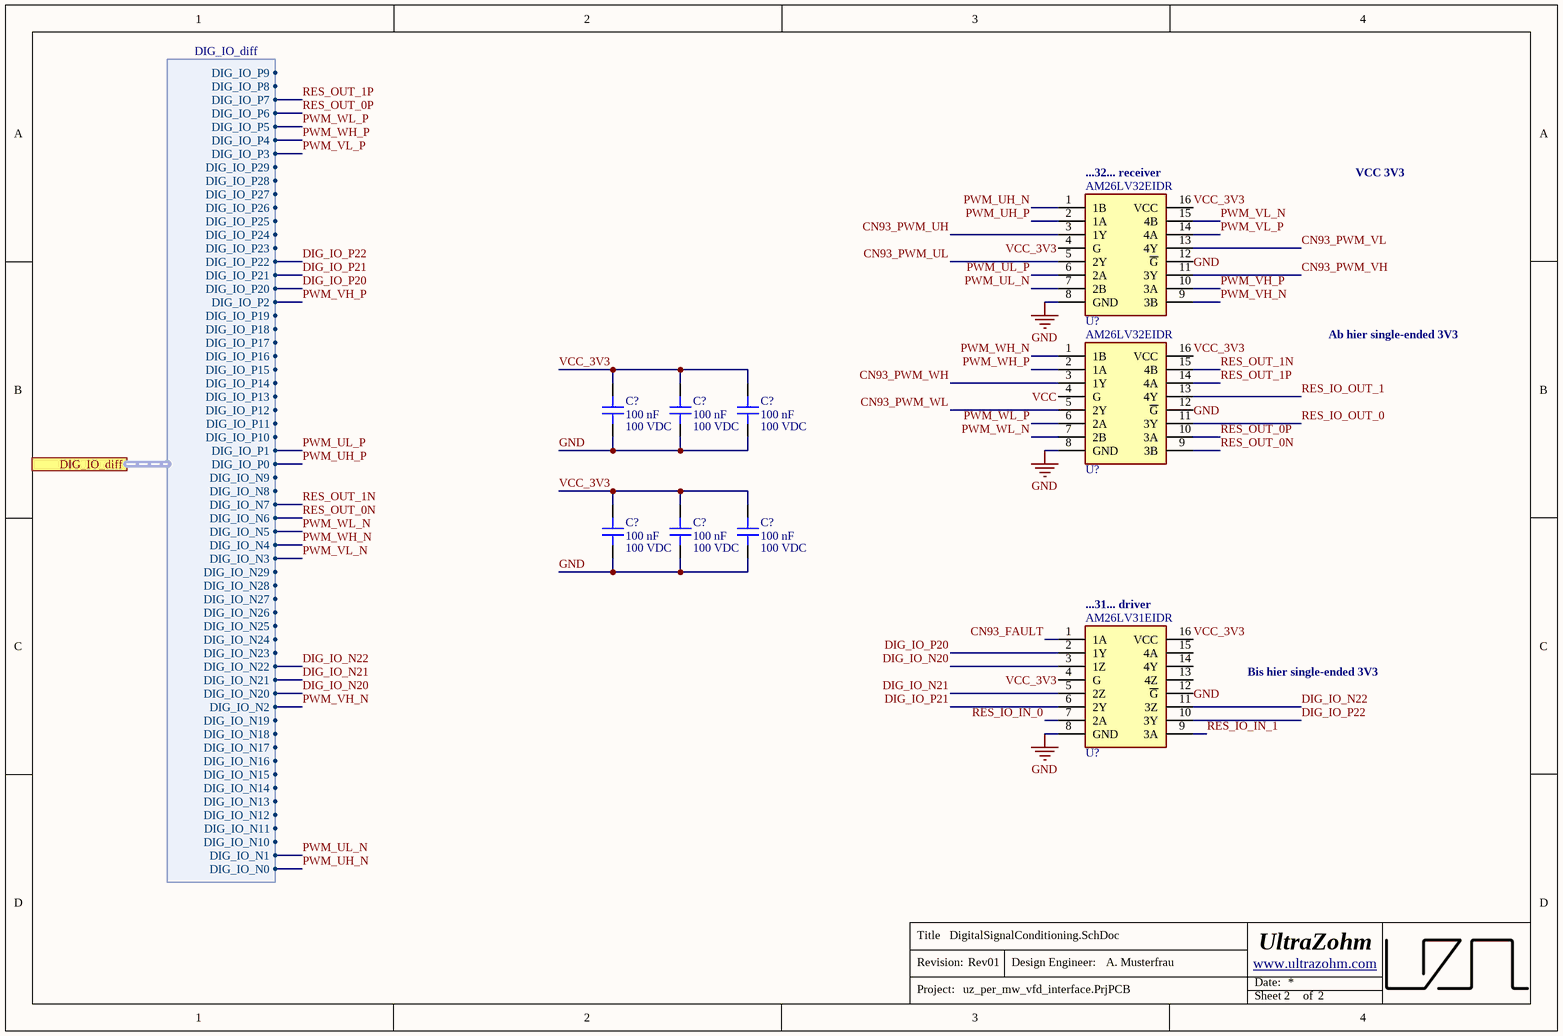
[diagram p3: DigitalSignalConditioning.SchDoc]

### Parts
(Parts that share a designator on the sheet are numbered #1, #2 ... from top to bottom, then left to right.)
C?#1  100 nF  Voltage Rating: 100 VDC  [C_0603]
C?#2  100 nF  Voltage Rating: 100 VDC  [C_0603]
C?#3  100 nF  Voltage Rating: 100 VDC  [C_0603]
C?#4  100 nF  Voltage Rating: 100 VDC  [C_0603]
C?#5  100 nF  Voltage Rating: 100 VDC  [C_0603]
C?#6  100 nF  Voltage Rating: 100 VDC  [C_0603]
U?#1  AM26LV32EIDR  [SOIC-16]
U?#2  AM26LV32EIDR  [SOIC-16]
U?#3  AM26LV31EIDR  [SOIC-16]

### Ports
DIG_IO_diff (harness DIG_IO_diff)

### Harnesses
DIG_IO_diff: DIG_IO_N0, DIG_IO_N1, DIG_IO_N10, DIG_IO_N11, DIG_IO_N12, DIG_IO_N13, DIG_IO_N14, DIG_IO_N15, DIG_IO_N16, DIG_IO_N17, DIG_IO_N18, DIG_IO_N19, DIG_IO_N2, DIG_IO_N20, DIG_IO_N21, DIG_IO_N22, DIG_IO_N23, DIG_IO_N24, DIG_IO_N25, DIG_IO_N26, DIG_IO_N27, DIG_IO_N28, DIG_IO_N29, DIG_IO_N3, DIG_IO_N4, DIG_IO_N5, DIG_IO_N6, DIG_IO_N7, DIG_IO_N9, DIG_IO_P0, DIG_IO_P1, DIG_IO_P10, DIG_IO_P11, DIG_IO_P12, DIG_IO_P13, DIG_IO_P14, DIG_IO_P15, DIG_IO_P16, DIG_IO_P17, DIG_IO_P18, DIG_IO_P19, DIG_IO_P2, DIG_IO_P20, DIG_IO_P21, DIG_IO_P22, DIG_IO_P23, DIG_IO_P24, DIG_IO_P25, DIG_IO_P26, DIG_IO_P27, DIG_IO_P28, DIG_IO_P29, DIG_IO_P3, DIG_IO_P4, DIG_IO_P5, DIG_IO_P6, DIG_IO_P7, DIG_IO_P8, DIG_IO_P9, DIG_IO_N8

### Nets
GND: C?#1.1 C?#2.1 C?#3.1 C?#4.1 C?#5.1 C?#6.1 U?#1.8(GND) U?#1.12(~{G}) U?#2.8(GND) U?#2.12(~{G}) U?#3.8(GND) U?#3.12(~{G})
CN93_FAULT: U?#3.1(1A)
CN93_PWM_UH: U?#1.3(1Y)
CN93_PWM_UL: U?#1.5(2Y)
CN93_PWM_VH: U?#1.11(3Y)
CN93_PWM_VL: U?#1.13(4Y)
CN93_PWM_WH: U?#2.3(1Y)
CN93_PWM_WL: U?#2.5(2Y)
DIG_IO_N20: U?#3.3(1Z) ; port DIG_IO_diff.DIG_IO_N20
DIG_IO_N21: U?#3.5(2Z) ; port DIG_IO_diff.DIG_IO_N21
DIG_IO_N22: U?#3.11(3Z) ; port DIG_IO_diff.DIG_IO_N22
DIG_IO_P20: U?#3.2(1Y) ; port DIG_IO_diff.DIG_IO_P20
DIG_IO_P21: U?#3.6(2Y) ; port DIG_IO_diff.DIG_IO_P21
DIG_IO_P22: U?#3.10(3Y) ; port DIG_IO_diff.DIG_IO_P22
PWM_UH_N: U?#1.1(1B) ; port DIG_IO_diff.DIG_IO_N0  [project net DIG_IO_N0]
PWM_UH_P: U?#1.2(1A) ; port DIG_IO_diff.DIG_IO_P0  [project net DIG_IO_P0]
PWM_UL_N: U?#1.7(2B) ; port DIG_IO_diff.DIG_IO_N1  [project net DIG_IO_N1]
PWM_UL_P: U?#1.6(2A) ; port DIG_IO_diff.DIG_IO_P1  [project net DIG_IO_P1]
PWM_VH_N: U?#1.9(3B) ; port DIG_IO_diff.DIG_IO_N2  [project net DIG_IO_N2]
PWM_VH_P: U?#1.10(3A) ; port DIG_IO_diff.DIG_IO_P2  [project net DIG_IO_P2]
PWM_VL_N: U?#1.15(4B) ; port DIG_IO_diff.DIG_IO_N3  [project net DIG_IO_N3]
PWM_VL_P: U?#1.14(4A) ; port DIG_IO_diff.DIG_IO_P3  [project net DIG_IO_P3]
PWM_WH_N: U?#2.1(1B) ; port DIG_IO_diff.DIG_IO_N4  [project net DIG_IO_N4]
PWM_WH_P: U?#2.2(1A) ; port DIG_IO_diff.DIG_IO_P4  [project net DIG_IO_P4]
PWM_WL_N: U?#2.7(2B) ; port DIG_IO_diff.DIG_IO_N5  [project net DIG_IO_N5]
PWM_WL_P: U?#2.6(2A) ; port DIG_IO_diff.DIG_IO_P5  [project net DIG_IO_P5]
RES_IO_IN_0: U?#3.7(2A)
RES_IO_IN_1: U?#3.9(3A)
RES_IO_OUT_0: U?#2.11(3Y)
RES_IO_OUT_1: U?#2.13(4Y)
RES_OUT_0N: U?#2.9(3B) ; port DIG_IO_diff.DIG_IO_N6  [project net DIG_IO_N6]
RES_OUT_0P: U?#2.10(3A) ; port DIG_IO_diff.DIG_IO_P6  [project net DIG_IO_P6]
RES_OUT_1N: U?#2.15(4B) ; port DIG_IO_diff.DIG_IO_N7  [project net DIG_IO_N7]
RES_OUT_1P: U?#2.14(4A) ; port DIG_IO_diff.DIG_IO_P7  [project net DIG_IO_P7]
VCC: U?#2.4(G)
VCC_3V3: C?#1.2 C?#2.2 C?#3.2 C?#4.2 C?#5.2 C?#6.2 U?#1.4(G) U?#1.16(VCC) U?#2.16(VCC) U?#3.4(G) U?#3.16(VCC)

Not connected (* = marked no-connect by the designer): U?#3 13(4Z) 14(4Y) 15(4A)

### Notes on the sheet
- (near U?#1) ...32... receiver
- VCC 3V3
- Ab hier single-ended 3V3
- (near U?#3) ...31... driver
- Bis hier single-ended 3V3
- Title
- Revision:
- Design Engineer:
- Date:
- Project:
- Sheet
- of

### Library data of the parts
C?#1-C?#6 = C1608X7S2A104KT000N: as C15 on sheet PowerSupply; Manufacturer Part Number: C1608X7S2A104KT000N; PartID: 148; Created On: 20.12.2020 13:54:13; ComponentLink1Description: Datasheet; ComponentLink1URL: https://datasheet.lcsc.com/lcsc/2304140030_TDK-C1608X7S2A104KT000N_C343025.pdf; Component Type: Capacitor 0603; Device Package: 0603; Last Updated: 14.12.2022 12:14:21; Mounting Type: SMD; Operating Temperature: -55 to 125°C; Series: X7R; Supplier 1: LCSC; Supplier Part Number 1: C343025; Type: Capacitor; Tolerance: 10 %; Value: 100 nF; Live Cycle Status: 1; LCSC Part Number: C343025; Stock number: not stored
U?#1 U?#2 = AM26LV32EIDR: Low-Voltage High-Speed Quadruple Differential Line Receiver; Manufacturer: Texas Instruments; Created from: FRosner; Manufacturer Part Number: AM26LV32EIDR; PartID: 5; Created On: 01.06.2026 09:11:13; ComponentLink1Description: Datasheet; ComponentLink1URL: https://www.ti.com/lit/ds/symlink/am26lv32e.pdf?ts=1780288728581; Component Type: RS-422-IC-Interface; Device Package: SOIC-16; Last Updated: 01.06.2026 09:11:13; Minimum Order: 1; Mounting Type: SMD; Operating Temperature: -40 - 125 °C; Series: AM26LV32E; Supplier 1: Mouser; Supplier Part Number 1: 595-AM26LV32EIDR; Supplier 2: LCSC; Supplier Part Number 2: C527448; Type: Standard; Live Cycle Status: 1; Stock number: not stored; LCSC Part Number: C527448
U?#3 = AM26LV31EIDR: Low-Voltage High-Speed Quadruple Differential Line Driver; Manufacturer: Texas Instruments; Created from: FRosner; Manufacturer Part Number: AM26LV31EIDR; PartID: 6; Created On: 01.06.2026 09:17:22; ComponentLink1Description: Datasheet; ComponentLink1URL: https://www.ti.com/lit/ds/symlink/am26lv31e.pdf?ts=1780283358979&ref_url=https%253A%252F%252Fwww.mouser.com%252F; Component Type: RS-422-IC-Interface; Device Package: SOIC-16; Last Updated: 01.06.2026 09:17:22; Minimum Order: 1; Mounting Type: SMD; Operating Temperature: -40 - 125 °C; Series: AM26LV31E; Supplier 1: Mouser; Supplier Part Number 1: 595-AM26LV31EIDR; Supplier 2: LCSC; Supplier Part Number 2: C527446; Type: Standard; Live Cycle Status: 1; Stock number: not stored; LCSC Part Number: C527446